# Altium schematic sheet 0014_Processor - MEMORY.SchDoc
size A3
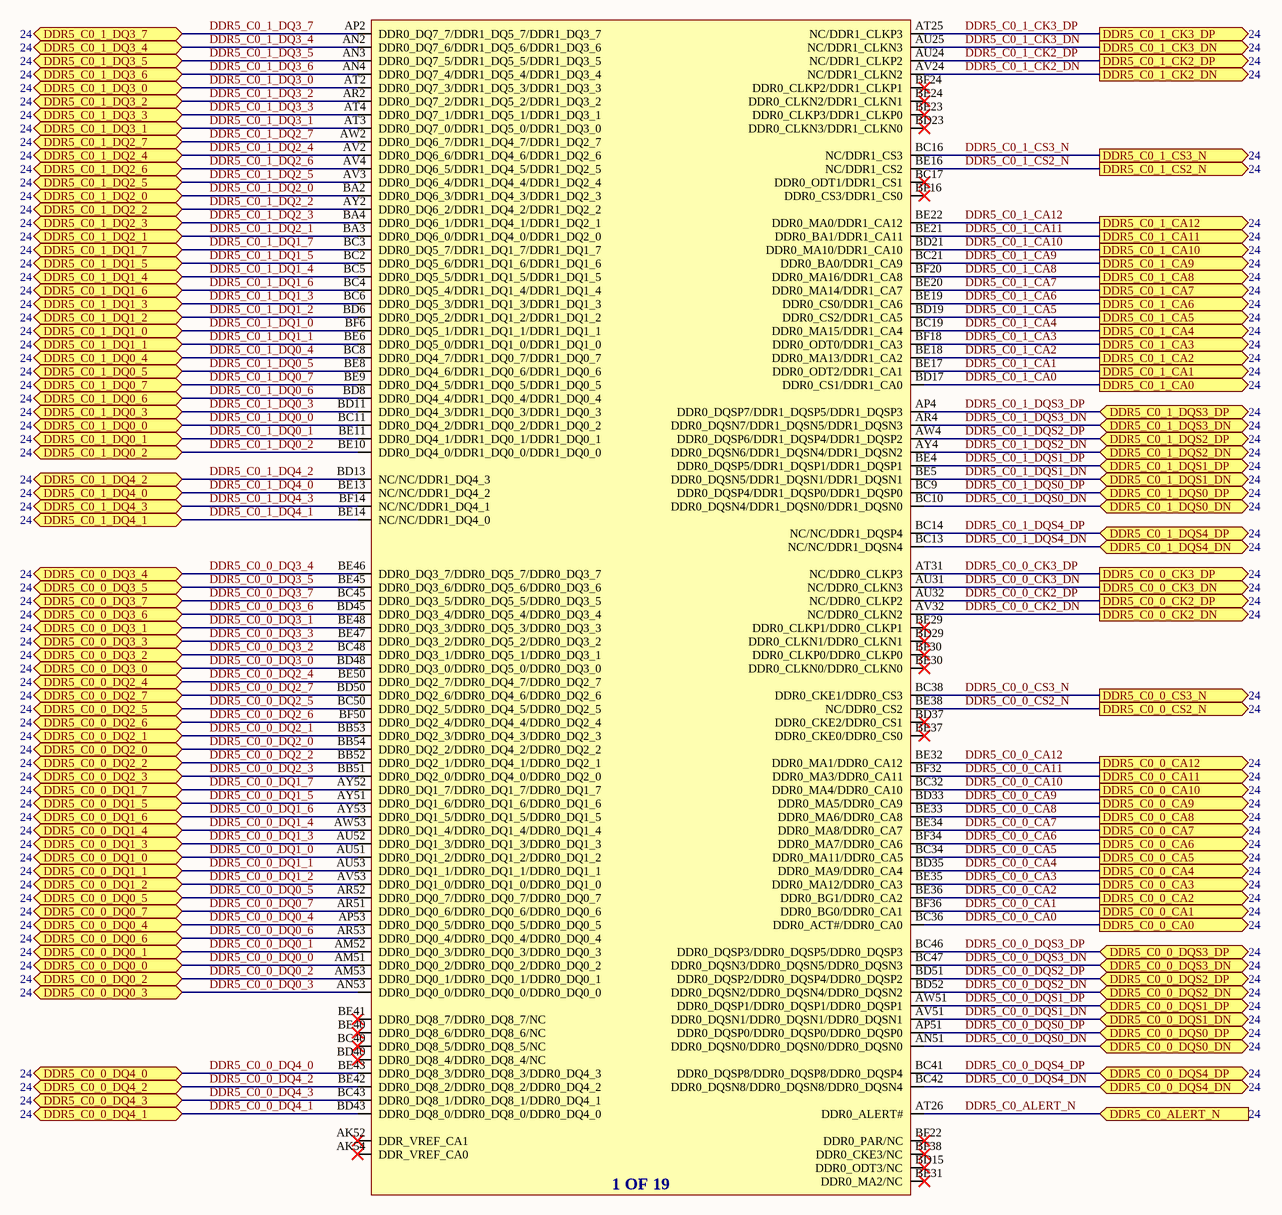
[diagram p0: 0014_Processor - MEMORY.SchDoc]

## Parts
U1401  C_RPL_HX_EXT  (value not drawn)  (part A of 19)

## Ports
DDR5_C0_0_CA0 (out), DDR5_C0_0_CA1 (out), DDR5_C0_0_CA2 (out), DDR5_C0_0_CA3 (out), DDR5_C0_0_CA4 (out), DDR5_C0_0_CA5 (out), DDR5_C0_0_CA6 (out), DDR5_C0_0_CA7 (out), DDR5_C0_0_CA8 (out), DDR5_C0_0_CA9 (out), DDR5_C0_0_CA10 (out), DDR5_C0_0_CA11 (out), DDR5_C0_0_CA12 (out), DDR5_C0_0_CK2_DN (out), DDR5_C0_0_CK2_DP (out), DDR5_C0_0_CK3_DN (out), DDR5_C0_0_CK3_DP (out), DDR5_C0_0_CS2_N (out), DDR5_C0_0_CS3_N (out), DDR5_C0_0_DQ0_0 (bidir), DDR5_C0_0_DQ0_1 (bidir), DDR5_C0_0_DQ0_2 (bidir), DDR5_C0_0_DQ0_3 (bidir), DDR5_C0_0_DQ0_4 (bidir), DDR5_C0_0_DQ0_5 (bidir), DDR5_C0_0_DQ0_6 (bidir), DDR5_C0_0_DQ0_7 (bidir), DDR5_C0_0_DQ1_0 (bidir), DDR5_C0_0_DQ1_1 (bidir), DDR5_C0_0_DQ1_2 (bidir), DDR5_C0_0_DQ1_3 (bidir), DDR5_C0_0_DQ1_4 (bidir), DDR5_C0_0_DQ1_5 (bidir), DDR5_C0_0_DQ1_6 (bidir), DDR5_C0_0_DQ1_7 (bidir), DDR5_C0_0_DQ2_0 (bidir), DDR5_C0_0_DQ2_1 (bidir), DDR5_C0_0_DQ2_2 (bidir), DDR5_C0_0_DQ2_3 (bidir), DDR5_C0_0_DQ2_4 (bidir), DDR5_C0_0_DQ2_5 (bidir), DDR5_C0_0_DQ2_6 (bidir), DDR5_C0_0_DQ2_7 (bidir), DDR5_C0_0_DQ3_0 (bidir), DDR5_C0_0_DQ3_1 (bidir), DDR5_C0_0_DQ3_2 (bidir), DDR5_C0_0_DQ3_3 (bidir), DDR5_C0_0_DQ3_4 (bidir), DDR5_C0_0_DQ3_5 (bidir), DDR5_C0_0_DQ3_6 (bidir), DDR5_C0_0_DQ3_7 (bidir), DDR5_C0_0_DQ4_0 (bidir), DDR5_C0_0_DQ4_1 (bidir), DDR5_C0_0_DQ4_2 (bidir), DDR5_C0_0_DQ4_3 (bidir), DDR5_C0_0_DQS0_DN (bidir), DDR5_C0_0_DQS0_DP (bidir), DDR5_C0_0_DQS1_DN (bidir), DDR5_C0_0_DQS1_DP (bidir), DDR5_C0_0_DQS2_DN (bidir), DDR5_C0_0_DQS2_DP (bidir), DDR5_C0_0_DQS3_DN (bidir), DDR5_C0_0_DQS3_DP (bidir), DDR5_C0_0_DQS4_DN (bidir), DDR5_C0_0_DQS4_DP (bidir), DDR5_C0_1_CA0 (out), DDR5_C0_1_CA1 (out), DDR5_C0_1_CA2 (out), DDR5_C0_1_CA3 (out), DDR5_C0_1_CA4 (out), DDR5_C0_1_CA5 (out), DDR5_C0_1_CA6 (out), DDR5_C0_1_CA7 (out), DDR5_C0_1_CA8 (out), DDR5_C0_1_CA9 (out), DDR5_C0_1_CA10 (out), DDR5_C0_1_CA11 (out), DDR5_C0_1_CA12 (out), DDR5_C0_1_CK2_DN (out), DDR5_C0_1_CK2_DP (out), DDR5_C0_1_CK3_DN (out), DDR5_C0_1_CK3_DP (out), DDR5_C0_1_CS2_N (out), DDR5_C0_1_CS3_N (out), DDR5_C0_1_DQ0_0 (bidir), DDR5_C0_1_DQ0_1 (bidir), DDR5_C0_1_DQ0_2 (bidir), DDR5_C0_1_DQ0_3 (bidir), DDR5_C0_1_DQ0_4 (bidir), DDR5_C0_1_DQ0_5 (bidir), DDR5_C0_1_DQ0_6 (bidir), DDR5_C0_1_DQ0_7 (bidir), DDR5_C0_1_DQ1_0 (bidir), DDR5_C0_1_DQ1_1 (bidir), DDR5_C0_1_DQ1_2 (bidir), DDR5_C0_1_DQ1_3 (bidir), DDR5_C0_1_DQ1_4 (bidir), DDR5_C0_1_DQ1_5 (bidir), DDR5_C0_1_DQ1_6 (bidir), DDR5_C0_1_DQ1_7 (bidir), DDR5_C0_1_DQ2_0 (bidir), DDR5_C0_1_DQ2_1 (bidir), DDR5_C0_1_DQ2_2 (bidir), DDR5_C0_1_DQ2_3 (bidir), DDR5_C0_1_DQ2_4 (bidir), DDR5_C0_1_DQ2_5 (bidir), DDR5_C0_1_DQ2_6 (bidir), DDR5_C0_1_DQ2_7 (bidir), DDR5_C0_1_DQ3_0 (bidir), DDR5_C0_1_DQ3_1 (bidir), DDR5_C0_1_DQ3_2 (bidir), DDR5_C0_1_DQ3_3 (bidir), DDR5_C0_1_DQ3_4 (bidir), DDR5_C0_1_DQ3_5 (bidir), DDR5_C0_1_DQ3_6 (bidir), DDR5_C0_1_DQ3_7 (bidir), DDR5_C0_1_DQ4_0 (bidir), DDR5_C0_1_DQ4_1 (bidir), DDR5_C0_1_DQ4_2 (bidir), DDR5_C0_1_DQ4_3 (bidir), DDR5_C0_1_DQS0_DN (bidir), DDR5_C0_1_DQS0_DP (bidir), DDR5_C0_1_DQS1_DN (bidir), DDR5_C0_1_DQS1_DP (bidir), DDR5_C0_1_DQS2_DN (bidir), DDR5_C0_1_DQS2_DP (bidir), DDR5_C0_1_DQS3_DN (bidir), DDR5_C0_1_DQS3_DP (bidir), DDR5_C0_1_DQS4_DN (bidir), DDR5_C0_1_DQS4_DP (bidir), DDR5_C0_ALERT_N (in)

## Nets
DDR5_C0_0_CA0: U1401.BC36(DDR0_ACT#/DDR0_CA0) ; port DDR5_C0_0_CA0
DDR5_C0_0_CA1: U1401.BF36(DDR0_BG0/DDR0_CA1) ; port DDR5_C0_0_CA1
DDR5_C0_0_CA2: U1401.BE36(DDR0_BG1/DDR0_CA2) ; port DDR5_C0_0_CA2
DDR5_C0_0_CA3: U1401.BE35(DDR0_MA12/DDR0_CA3) ; port DDR5_C0_0_CA3
DDR5_C0_0_CA4: U1401.BD35(DDR0_MA9/DDR0_CA4) ; port DDR5_C0_0_CA4
DDR5_C0_0_CA5: U1401.BC34(DDR0_MA11/DDR0_CA5) ; port DDR5_C0_0_CA5
DDR5_C0_0_CA6: U1401.BF34(DDR0_MA7/DDR0_CA6) ; port DDR5_C0_0_CA6
DDR5_C0_0_CA7: U1401.BE34(DDR0_MA8/DDR0_CA7) ; port DDR5_C0_0_CA7
DDR5_C0_0_CA8: U1401.BE33(DDR0_MA6/DDR0_CA8) ; port DDR5_C0_0_CA8
DDR5_C0_0_CA9: U1401.BD33(DDR0_MA5/DDR0_CA9) ; port DDR5_C0_0_CA9
DDR5_C0_0_CA10: U1401.BC32(DDR0_MA4/DDR0_CA10) ; port DDR5_C0_0_CA10
DDR5_C0_0_CA11: U1401.BF32(DDR0_MA3/DDR0_CA11) ; port DDR5_C0_0_CA11
DDR5_C0_0_CA12: U1401.BE32(DDR0_MA1/DDR0_CA12) ; port DDR5_C0_0_CA12
DDR5_C0_0_CK2_DN: U1401.AV32(NC/DDR0_CLKN2) ; port DDR5_C0_0_CK2_DN
DDR5_C0_0_CK2_DP: U1401.AU32(NC/DDR0_CLKP2) ; port DDR5_C0_0_CK2_DP
DDR5_C0_0_CK3_DN: U1401.AU31(NC/DDR0_CLKN3) ; port DDR5_C0_0_CK3_DN
DDR5_C0_0_CK3_DP: U1401.AT31(NC/DDR0_CLKP3) ; port DDR5_C0_0_CK3_DP
DDR5_C0_0_CS2_N: U1401.BE38(NC/DDR0_CS2) ; port DDR5_C0_0_CS2_N
DDR5_C0_0_CS3_N: U1401.BC38(DDR0_CKE1/DDR0_CS3) ; port DDR5_C0_0_CS3_N
DDR5_C0_0_DQ0_0: U1401.AM51(DDR0_DQ0_2/DDR0_DQ0_2/DDR0_DQ0_2) ; port DDR5_C0_0_DQ0_0
DDR5_C0_0_DQ0_1: U1401.AM52(DDR0_DQ0_3/DDR0_DQ0_3/DDR0_DQ0_3) ; port DDR5_C0_0_DQ0_1
DDR5_C0_0_DQ0_2: U1401.AM53(DDR0_DQ0_1/DDR0_DQ0_1/DDR0_DQ0_1) ; port DDR5_C0_0_DQ0_2
DDR5_C0_0_DQ0_3: U1401.AN53(DDR0_DQ0_0/DDR0_DQ0_0/DDR0_DQ0_0) ; port DDR5_C0_0_DQ0_3
DDR5_C0_0_DQ0_4: U1401.AP53(DDR0_DQ0_5/DDR0_DQ0_5/DDR0_DQ0_5) ; port DDR5_C0_0_DQ0_4
DDR5_C0_0_DQ0_5: U1401.AR52(DDR0_DQ0_7/DDR0_DQ0_7/DDR0_DQ0_7) ; port DDR5_C0_0_DQ0_5
DDR5_C0_0_DQ0_6: U1401.AR53(DDR0_DQ0_4/DDR0_DQ0_4/DDR0_DQ0_4) ; port DDR5_C0_0_DQ0_6
DDR5_C0_0_DQ0_7: U1401.AR51(DDR0_DQ0_6/DDR0_DQ0_6/DDR0_DQ0_6) ; port DDR5_C0_0_DQ0_7
DDR5_C0_0_DQ1_0: U1401.AU51(DDR0_DQ1_2/DDR0_DQ1_2/DDR0_DQ1_2) ; port DDR5_C0_0_DQ1_0
DDR5_C0_0_DQ1_1: U1401.AU53(DDR0_DQ1_1/DDR0_DQ1_1/DDR0_DQ1_1) ; port DDR5_C0_0_DQ1_1
DDR5_C0_0_DQ1_2: U1401.AV53(DDR0_DQ1_0/DDR0_DQ1_0/DDR0_DQ1_0) ; port DDR5_C0_0_DQ1_2
DDR5_C0_0_DQ1_3: U1401.AU52(DDR0_DQ1_3/DDR0_DQ1_3/DDR0_DQ1_3) ; port DDR5_C0_0_DQ1_3
DDR5_C0_0_DQ1_4: U1401.AW53(DDR0_DQ1_4/DDR0_DQ1_4/DDR0_DQ1_4) ; port DDR5_C0_0_DQ1_4
DDR5_C0_0_DQ1_5: U1401.AY51(DDR0_DQ1_6/DDR0_DQ1_6/DDR0_DQ1_6) ; port DDR5_C0_0_DQ1_5
DDR5_C0_0_DQ1_6: U1401.AY53(DDR0_DQ1_5/DDR0_DQ1_5/DDR0_DQ1_5) ; port DDR5_C0_0_DQ1_6
DDR5_C0_0_DQ1_7: U1401.AY52(DDR0_DQ1_7/DDR0_DQ1_7/DDR0_DQ1_7) ; port DDR5_C0_0_DQ1_7
DDR5_C0_0_DQ2_0: U1401.BB54(DDR0_DQ2_2/DDR0_DQ4_2/DDR0_DQ2_2) ; port DDR5_C0_0_DQ2_0
DDR5_C0_0_DQ2_1: U1401.BB53(DDR0_DQ2_3/DDR0_DQ4_3/DDR0_DQ2_3) ; port DDR5_C0_0_DQ2_1
DDR5_C0_0_DQ2_2: U1401.BB52(DDR0_DQ2_1/DDR0_DQ4_1/DDR0_DQ2_1) ; port DDR5_C0_0_DQ2_2
DDR5_C0_0_DQ2_3: U1401.BB51(DDR0_DQ2_0/DDR0_DQ4_0/DDR0_DQ2_0) ; port DDR5_C0_0_DQ2_3
DDR5_C0_0_DQ2_4: U1401.BE50(DDR0_DQ2_7/DDR0_DQ4_7/DDR0_DQ2_7) ; port DDR5_C0_0_DQ2_4
DDR5_C0_0_DQ2_5: U1401.BC50(DDR0_DQ2_5/DDR0_DQ4_5/DDR0_DQ2_5) ; port DDR5_C0_0_DQ2_5
DDR5_C0_0_DQ2_6: U1401.BF50(DDR0_DQ2_4/DDR0_DQ4_4/DDR0_DQ2_4) ; port DDR5_C0_0_DQ2_6
DDR5_C0_0_DQ2_7: U1401.BD50(DDR0_DQ2_6/DDR0_DQ4_6/DDR0_DQ2_6) ; port DDR5_C0_0_DQ2_7
DDR5_C0_0_DQ3_0: U1401.BD48(DDR0_DQ3_0/DDR0_DQ5_0/DDR0_DQ3_0) ; port DDR5_C0_0_DQ3_0
DDR5_C0_0_DQ3_1: U1401.BE48(DDR0_DQ3_3/DDR0_DQ5_3/DDR0_DQ3_3) ; port DDR5_C0_0_DQ3_1
DDR5_C0_0_DQ3_2: U1401.BC48(DDR0_DQ3_1/DDR0_DQ5_1/DDR0_DQ3_1) ; port DDR5_C0_0_DQ3_2
DDR5_C0_0_DQ3_3: U1401.BE47(DDR0_DQ3_2/DDR0_DQ5_2/DDR0_DQ3_2) ; port DDR5_C0_0_DQ3_3
DDR5_C0_0_DQ3_4: U1401.BE46(DDR0_DQ3_7/DDR0_DQ5_7/DDR0_DQ3_7) ; port DDR5_C0_0_DQ3_4
DDR5_C0_0_DQ3_5: U1401.BE45(DDR0_DQ3_6/DDR0_DQ5_6/DDR0_DQ3_6) ; port DDR5_C0_0_DQ3_5
DDR5_C0_0_DQ3_6: U1401.BD45(DDR0_DQ3_4/DDR0_DQ5_4/DDR0_DQ3_4) ; port DDR5_C0_0_DQ3_6
DDR5_C0_0_DQ3_7: U1401.BC45(DDR0_DQ3_5/DDR0_DQ5_5/DDR0_DQ3_5) ; port DDR5_C0_0_DQ3_7
DDR5_C0_0_DQ4_0: U1401.BE43(DDR0_DQ8_3/DDR0_DQ8_3/DDR0_DQ4_3) ; port DDR5_C0_0_DQ4_0
DDR5_C0_0_DQ4_1: U1401.BD43(DDR0_DQ8_0/DDR0_DQ8_0/DDR0_DQ4_0) ; port DDR5_C0_0_DQ4_1
DDR5_C0_0_DQ4_2: U1401.BE42(DDR0_DQ8_2/DDR0_DQ8_2/DDR0_DQ4_2) ; port DDR5_C0_0_DQ4_2
DDR5_C0_0_DQ4_3: U1401.BC43(DDR0_DQ8_1/DDR0_DQ8_1/DDR0_DQ4_1) ; port DDR5_C0_0_DQ4_3
DDR5_C0_0_DQS0_DN: U1401.AN51(DDR0_DQSN0/DDR0_DQSN0/DDR0_DQSN0) ; port DDR5_C0_0_DQS0_DN
DDR5_C0_0_DQS0_DP: U1401.AP51(DDR0_DQSP0/DDR0_DQSP0/DDR0_DQSP0) ; port DDR5_C0_0_DQS0_DP
DDR5_C0_0_DQS1_DN: U1401.AV51(DDR0_DQSN1/DDR0_DQSN1/DDR0_DQSN1) ; port DDR5_C0_0_DQS1_DN
DDR5_C0_0_DQS1_DP: U1401.AW51(DDR0_DQSP1/DDR0_DQSP1/DDR0_DQSP1) ; port DDR5_C0_0_DQS1_DP
DDR5_C0_0_DQS2_DN: U1401.BD52(DDR0_DQSN2/DDR0_DQSN4/DDR0_DQSN2) ; port DDR5_C0_0_DQS2_DN
DDR5_C0_0_DQS2_DP: U1401.BD51(DDR0_DQSP2/DDR0_DQSP4/DDR0_DQSP2) ; port DDR5_C0_0_DQS2_DP
DDR5_C0_0_DQS3_DN: U1401.BC47(DDR0_DQSN3/DDR0_DQSN5/DDR0_DQSN3) ; port DDR5_C0_0_DQS3_DN
DDR5_C0_0_DQS3_DP: U1401.BC46(DDR0_DQSP3/DDR0_DQSP5/DDR0_DQSP3) ; port DDR5_C0_0_DQS3_DP
DDR5_C0_0_DQS4_DN: U1401.BC42(DDR0_DQSN8/DDR0_DQSN8/DDR0_DQSN4) ; port DDR5_C0_0_DQS4_DN
DDR5_C0_0_DQS4_DP: U1401.BC41(DDR0_DQSP8/DDR0_DQSP8/DDR0_DQSP4) ; port DDR5_C0_0_DQS4_DP
DDR5_C0_1_CA0: U1401.BD17(DDR0_CS1/DDR1_CA0) ; port DDR5_C0_1_CA0
DDR5_C0_1_CA1: U1401.BE17(DDR0_ODT2/DDR1_CA1) ; port DDR5_C0_1_CA1
DDR5_C0_1_CA2: U1401.BE18(DDR0_MA13/DDR1_CA2) ; port DDR5_C0_1_CA2
DDR5_C0_1_CA3: U1401.BF18(DDR0_ODT0/DDR1_CA3) ; port DDR5_C0_1_CA3
DDR5_C0_1_CA4: U1401.BC19(DDR0_MA15/DDR1_CA4) ; port DDR5_C0_1_CA4
DDR5_C0_1_CA5: U1401.BD19(DDR0_CS2/DDR1_CA5) ; port DDR5_C0_1_CA5
DDR5_C0_1_CA6: U1401.BE19(DDR0_CS0/DDR1_CA6) ; port DDR5_C0_1_CA6
DDR5_C0_1_CA7: U1401.BE20(DDR0_MA14/DDR1_CA7) ; port DDR5_C0_1_CA7
DDR5_C0_1_CA8: U1401.BF20(DDR0_MA16/DDR1_CA8) ; port DDR5_C0_1_CA8
DDR5_C0_1_CA9: U1401.BC21(DDR0_BA0/DDR1_CA9) ; port DDR5_C0_1_CA9
DDR5_C0_1_CA10: U1401.BD21(DDR0_MA10/DDR1_CA10) ; port DDR5_C0_1_CA10
DDR5_C0_1_CA11: U1401.BE21(DDR0_BA1/DDR1_CA11) ; port DDR5_C0_1_CA11
DDR5_C0_1_CA12: U1401.BE22(DDR0_MA0/DDR1_CA12) ; port DDR5_C0_1_CA12
DDR5_C0_1_CK2_DN: U1401.AV24(NC/DDR1_CLKN2) ; port DDR5_C0_1_CK2_DN
DDR5_C0_1_CK2_DP: U1401.AU24(NC/DDR1_CLKP2) ; port DDR5_C0_1_CK2_DP
DDR5_C0_1_CK3_DN: U1401.AU25(NC/DDR1_CLKN3) ; port DDR5_C0_1_CK3_DN
DDR5_C0_1_CK3_DP: U1401.AT25(NC/DDR1_CLKP3) ; port DDR5_C0_1_CK3_DP
DDR5_C0_1_CS2_N: U1401.BE16(NC/DDR1_CS2) ; port DDR5_C0_1_CS2_N
DDR5_C0_1_CS3_N: U1401.BC16(NC/DDR1_CS3) ; port DDR5_C0_1_CS3_N
DDR5_C0_1_DQ0_0: U1401.BC11(DDR0_DQ4_2/DDR1_DQ0_2/DDR1_DQ0_2) ; port DDR5_C0_1_DQ0_0
DDR5_C0_1_DQ0_1: U1401.BE11(DDR0_DQ4_1/DDR1_DQ0_1/DDR1_DQ0_1) ; port DDR5_C0_1_DQ0_1
DDR5_C0_1_DQ0_2: U1401.BE10(DDR0_DQ4_0/DDR1_DQ0_0/DDR1_DQ0_0) ; port DDR5_C0_1_DQ0_2
DDR5_C0_1_DQ0_3: U1401.BD11(DDR0_DQ4_3/DDR1_DQ0_3/DDR1_DQ0_3) ; port DDR5_C0_1_DQ0_3
DDR5_C0_1_DQ0_4: U1401.BC8(DDR0_DQ4_7/DDR1_DQ0_7/DDR1_DQ0_7) ; port DDR5_C0_1_DQ0_4
DDR5_C0_1_DQ0_5: U1401.BE8(DDR0_DQ4_6/DDR1_DQ0_6/DDR1_DQ0_6) ; port DDR5_C0_1_DQ0_5
DDR5_C0_1_DQ0_6: U1401.BD8(DDR0_DQ4_4/DDR1_DQ0_4/DDR1_DQ0_4) ; port DDR5_C0_1_DQ0_6
DDR5_C0_1_DQ0_7: U1401.BE9(DDR0_DQ4_5/DDR1_DQ0_5/DDR1_DQ0_5) ; port DDR5_C0_1_DQ0_7
DDR5_C0_1_DQ1_0: U1401.BF6(DDR0_DQ5_1/DDR1_DQ1_1/DDR1_DQ1_1) ; port DDR5_C0_1_DQ1_0
DDR5_C0_1_DQ1_1: U1401.BE6(DDR0_DQ5_0/DDR1_DQ1_0/DDR1_DQ1_0) ; port DDR5_C0_1_DQ1_1
DDR5_C0_1_DQ1_2: U1401.BD6(DDR0_DQ5_2/DDR1_DQ1_2/DDR1_DQ1_2) ; port DDR5_C0_1_DQ1_2
DDR5_C0_1_DQ1_3: U1401.BC6(DDR0_DQ5_3/DDR1_DQ1_3/DDR1_DQ1_3) ; port DDR5_C0_1_DQ1_3
DDR5_C0_1_DQ1_4: U1401.BC5(DDR0_DQ5_5/DDR1_DQ1_5/DDR1_DQ1_5) ; port DDR5_C0_1_DQ1_4
DDR5_C0_1_DQ1_5: U1401.BC2(DDR0_DQ5_6/DDR1_DQ1_6/DDR1_DQ1_6) ; port DDR5_C0_1_DQ1_5
DDR5_C0_1_DQ1_6: U1401.BC4(DDR0_DQ5_4/DDR1_DQ1_4/DDR1_DQ1_4) ; port DDR5_C0_1_DQ1_6
DDR5_C0_1_DQ1_7: U1401.BC3(DDR0_DQ5_7/DDR1_DQ1_7/DDR1_DQ1_7) ; port DDR5_C0_1_DQ1_7
DDR5_C0_1_DQ2_0: U1401.BA2(DDR0_DQ6_3/DDR1_DQ4_3/DDR1_DQ2_3) ; port DDR5_C0_1_DQ2_0
DDR5_C0_1_DQ2_1: U1401.BA3(DDR0_DQ6_0/DDR1_DQ4_0/DDR1_DQ2_0) ; port DDR5_C0_1_DQ2_1
DDR5_C0_1_DQ2_2: U1401.AY2(DDR0_DQ6_2/DDR1_DQ4_2/DDR1_DQ2_2) ; port DDR5_C0_1_DQ2_2
DDR5_C0_1_DQ2_3: U1401.BA4(DDR0_DQ6_1/DDR1_DQ4_1/DDR1_DQ2_1) ; port DDR5_C0_1_DQ2_3
DDR5_C0_1_DQ2_4: U1401.AV2(DDR0_DQ6_6/DDR1_DQ4_6/DDR1_DQ2_6) ; port DDR5_C0_1_DQ2_4
DDR5_C0_1_DQ2_5: U1401.AV3(DDR0_DQ6_4/DDR1_DQ4_4/DDR1_DQ2_4) ; port DDR5_C0_1_DQ2_5
DDR5_C0_1_DQ2_6: U1401.AV4(DDR0_DQ6_5/DDR1_DQ4_5/DDR1_DQ2_5) ; port DDR5_C0_1_DQ2_6
DDR5_C0_1_DQ2_7: U1401.AW2(DDR0_DQ6_7/DDR1_DQ4_7/DDR1_DQ2_7) ; port DDR5_C0_1_DQ2_7
DDR5_C0_1_DQ3_0: U1401.AT2(DDR0_DQ7_3/DDR1_DQ5_3/DDR1_DQ3_3) ; port DDR5_C0_1_DQ3_0
DDR5_C0_1_DQ3_1: U1401.AT3(DDR0_DQ7_0/DDR1_DQ5_0/DDR1_DQ3_0) ; port DDR5_C0_1_DQ3_1
DDR5_C0_1_DQ3_2: U1401.AR2(DDR0_DQ7_2/DDR1_DQ5_2/DDR1_DQ3_2) ; port DDR5_C0_1_DQ3_2
DDR5_C0_1_DQ3_3: U1401.AT4(DDR0_DQ7_1/DDR1_DQ5_1/DDR1_DQ3_1) ; port DDR5_C0_1_DQ3_3
DDR5_C0_1_DQ3_4: U1401.AN2(DDR0_DQ7_6/DDR1_DQ5_6/DDR1_DQ3_6) ; port DDR5_C0_1_DQ3_4
DDR5_C0_1_DQ3_5: U1401.AN3(DDR0_DQ7_5/DDR1_DQ5_5/DDR1_DQ3_5) ; port DDR5_C0_1_DQ3_5
DDR5_C0_1_DQ3_6: U1401.AN4(DDR0_DQ7_4/DDR1_DQ5_4/DDR1_DQ3_4) ; port DDR5_C0_1_DQ3_6
DDR5_C0_1_DQ3_7: U1401.AP2(DDR0_DQ7_7/DDR1_DQ5_7/DDR1_DQ3_7) ; port DDR5_C0_1_DQ3_7
DDR5_C0_1_DQ4_0: U1401.BE13(NC/NC/DDR1_DQ4_2) ; port DDR5_C0_1_DQ4_0
DDR5_C0_1_DQ4_1: U1401.BE14(NC/NC/DDR1_DQ4_0) ; port DDR5_C0_1_DQ4_1
DDR5_C0_1_DQ4_2: U1401.BD13(NC/NC/DDR1_DQ4_3) ; port DDR5_C0_1_DQ4_2
DDR5_C0_1_DQ4_3: U1401.BF14(NC/NC/DDR1_DQ4_1) ; port DDR5_C0_1_DQ4_3
DDR5_C0_1_DQS0_DN: U1401.BC10(DDR0_DQSN4/DDR1_DQSN0/DDR1_DQSN0) ; port DDR5_C0_1_DQS0_DN
DDR5_C0_1_DQS0_DP: U1401.BC9(DDR0_DQSP4/DDR1_DQSP0/DDR1_DQSP0) ; port DDR5_C0_1_DQS0_DP
DDR5_C0_1_DQS1_DN: U1401.BE5(DDR0_DQSN5/DDR1_DQSN1/DDR1_DQSN1) ; port DDR5_C0_1_DQS1_DN
DDR5_C0_1_DQS1_DP: U1401.BE4(DDR0_DQSP5/DDR1_DQSP1/DDR1_DQSP1) ; port DDR5_C0_1_DQS1_DP
DDR5_C0_1_DQS2_DN: U1401.AY4(DDR0_DQSN6/DDR1_DQSN4/DDR1_DQSN2) ; port DDR5_C0_1_DQS2_DN
DDR5_C0_1_DQS2_DP: U1401.AW4(DDR0_DQSP6/DDR1_DQSP4/DDR1_DQSP2) ; port DDR5_C0_1_DQS2_DP
DDR5_C0_1_DQS3_DN: U1401.AR4(DDR0_DQSN7/DDR1_DQSN5/DDR1_DQSN3) ; port DDR5_C0_1_DQS3_DN
DDR5_C0_1_DQS3_DP: U1401.AP4(DDR0_DQSP7/DDR1_DQSP5/DDR1_DQSP3) ; port DDR5_C0_1_DQS3_DP
DDR5_C0_1_DQS4_DN: U1401.BC13(NC/NC/DDR1_DQSN4) ; port DDR5_C0_1_DQS4_DN
DDR5_C0_1_DQS4_DP: U1401.BC14(NC/NC/DDR1_DQSP4) ; port DDR5_C0_1_DQS4_DP
DDR5_C0_ALERT_N: U1401.AT26(DDR0_ALERT#) ; port DDR5_C0_ALERT_N

Not connected (* = marked no-connect by the designer): U1401 AK52(DDR_VREF_CA1)* AK54(DDR_VREF_CA0)* BC17(DDR0_ODT1/DDR1_CS1)* BC40(DDR0_DQ8_5/DDR0_DQ8_5/NC)* BD15(DDR0_ODT3/NC)* BD23(DDR0_CLKN3/DDR1_CLKN0)* BD29(DDR0_CLKN1/DDR0_CLKN1)* BD37(DDR0_CKE2/DDR0_CS1)* BD40(DDR0_DQ8_4/DDR0_DQ8_4/NC)* BE23(DDR0_CLKP3/DDR1_CLKP0)* BE24(DDR0_CLKN2/DDR1_CLKN1)* BE29(DDR0_CLKP1/DDR0_CLKP1)* BE30(DDR0_CLKN0/DDR0_CLKN0)* BE31(DDR0_MA2/NC)* BE37(DDR0_CKE0/DDR0_CS0)* BE40(DDR0_DQ8_6/DDR0_DQ8_6/NC)* BE41(DDR0_DQ8_7/DDR0_DQ8_7/NC)* BF16(DDR0_CS3/DDR1_CS0)* BF22(DDR0_PAR/NC)* BF24(DDR0_CLKP2/DDR1_CLKP1)* BF30(DDR0_CLKP0/DDR0_CLKP0)* BF38(DDR0_CKE3/NC)*

## Notes on the sheet
- (in symbol C_RPL_HX_EXT, part A) 1 OF 19